# Altium project 28Pins_Project_v1I2.PrjPcb (part 2 of 3)
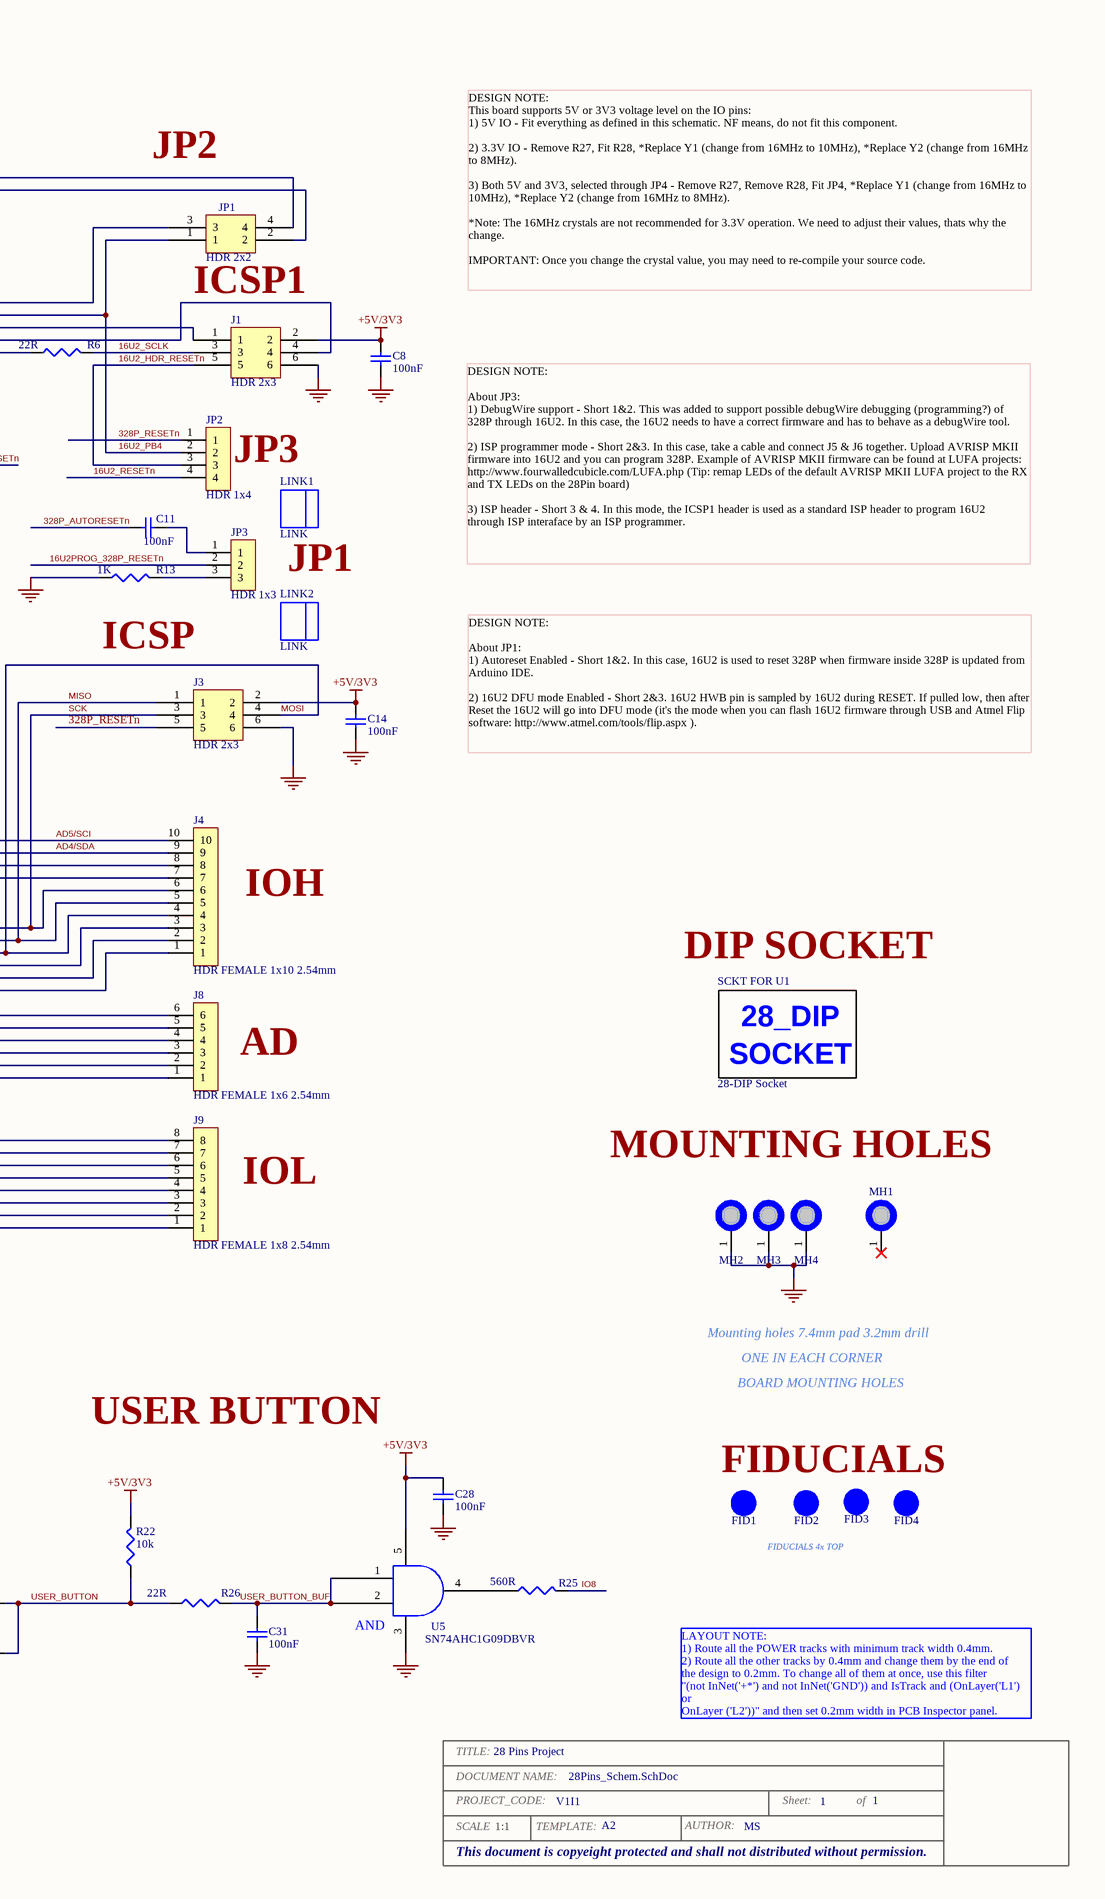
[diagram p2: 28Pins_Schem.SchDoc, right]

## Sheet 28Pins_Schem.SchDoc: 28 Pins Project (continued)
### Library data of the parts
28_Pins_Project = TitleBlock: Standard Title Block
C1 C12 C13 C15 C19 C21 C22 = C2012X5R1C106M125AC: CERAMIC CAPACITOR, 10UF, 16V, X5R, 20%, 0805, FULL REEL; Product Range:C Series; Capacitance:10 F; Capacitance Tolerance: 20%; Dielectric Characteristic:X5R; Voltage Rating:16V; Ceramic Capacitor Case:0805 [2012 Metric]; MSL:- ;RoHS Compliant: Yes; Manufacturer: TDK; Supplier 1: Farnell; Manufacturer Part Number: C2012X5R1C106M125AC; RoHS: Yes; Category: Ceramic Capacitors; Pricing 1: 5=0.27200, 50=0.09480, 250=0.08030, 500=0.07090, 1000=0.06220, 2000=0.04880, 10000=0.04830, 20000=0.04180 (GBP); Mount: Surface Mount; Case/Package: 0805; Number of Pins: 2; Case Code (Metric): 2012; Case Code (Imperial): 0805; Dielectric Material: Ceramic; Weight: 0.000194oz; Min Operating Temperature: -55°C; Max Operating Temperature: 85°C; Capacitance: 10uF; Tolerance: 20%; Voltage Rating: 16V; Packaging: Tape and Reel; Voltage Rating (DC): 16V; Dielectric: X5R; Termination: SMD/SMT; Package Quantity: 1; Resistor Type: Ceramic; Series: C; Length: 0.079inch; Width: 0.049inch; Height: 1.25mm; Depth: 1.25mm; Thickness: 0.057inch; RoHS Compliant: Yes; REACH SVHC: No SVHC; Lead Free: Lead Free; ComponentLink1URL: https://datasheet.ciiva.com/6289/tdkmlcccaprange-6289238.pdf?src-supplier=Digi-Key; ComponentLink1Description: https://datasheet.ciiva.com/6289/tdkmlcccaprange-6289238.pdf?src-supplier=Digi-Key; ComponentLink2URL: https://datasheet.ciiva.com/22725/1913358-22725558.pdf?src-supplier=Element14; ComponentLink2Description: https://datasheet.ciiva.com/22725/1913358-22725558.pdf?src-supplier=Element14; ComponentLink3URL: https://datasheet.ciiva.com/6252/tdkmlcccaprange-6252105.pdf?src-supplier=Digi-Key; ComponentLink3Description: https://datasheet.ciiva.com/6252/tdkmlcccaprange-6252105.pdf?src-supplier=Digi-Key; ComponentLink4URL: https://datasheet.ciiva.com/6252/tdkmlcccaprange-6252108.pdf?src-supplier=Digi-Key; ComponentLink4Description: https://datasheet.ciiva.com/6252/tdkmlcccaprange-6252108.pdf?src-supplier=Digi-Key; ComponentLink5URL: https://datasheet.ciiva.com/23803/1796654-23803022.pdf?src-supplier=Newark; ComponentLink5Description: https://datasheet.ciiva.com/23803/1796654-23803022.pdf?src-supplier=Newark; Supplier Part Number 1: 2525134
C2-C4 C8 C11 C14 C16-C18 C20 C23 C24 C27-C33 = C2012X7R1H104K085AA: C Series 0805 0.1 uF 50 V ±10 % Tolerance X7R SMT Multilayer Ceramic Capacitor; Manufacturer: TDK; Tolerance: 10%; Voltage Rating: 50V; Supplier 1: Newark; Manufacturer Part Number: C2012X7R1H104K085AA; RoHS: Yes; Category: Ceramic Capacitors; Stock 1: 16000; Pricing 1: 1=0.02600, 4000=0.02500, 8000=0.02400 (USD); Mount: Surface Mount; Case/Package: 0805; Number of Pins: 2; Case Code (Metric): 2012; Case Code (Imperial): 0805; Weight: 0.000194oz; Dielectric Material: Ceramic; Min Operating Temperature: -55°C; Max Operating Temperature: 125°C; Capacitance: 100nF; Dielectric: X7R; Packaging: Tape and Reel; Voltage Rating (DC): 50V; Termination: SMD/SMT; Construction: Flat; Package Quantity: 1; Resistor Type: Ceramic; Voltage: 50V; Series: C; Length: 2mm; Width: 0.049inch; Height: 0.85mm; Depth: 1.25mm; Thickness: 0.037inch; Radiation Hardening: No; RoHS Compliant: Yes; REACH SVHC: No SVHC; Lead Free: Lead Free; ComponentLink1URL: https://datasheet.ciiva.com/11788/0900766b80c1bb00-11788128.pdf?src-supplier=RSComponents; ComponentLink1Description: https://datasheet.ciiva.com/11788/0900766b80c1bb00-11788128.pdf?src-supplier=RSComponents; ComponentLink2URL: https://datasheet.ciiva.com/6250/tdkmlcccaprange-6250821.pdf?src-supplier=Digi-Key; ComponentLink2Description: https://datasheet.ciiva.com/6250/tdkmlcccaprange-6250821.pdf?src-supplier=Digi-Key; ComponentLink3URL: https://datasheet.ciiva.com/24191/e412-c-24191447.pdf?src-supplier=Future+Electronics; ComponentLink3Description: https://datasheet.ciiva.com/24191/e412-c-24191447.pdf?src-supplier=Future+Electronics; ComponentLink4URL: https://datasheet.ciiva.com/6250/tdkmlcccaprange-6250824.pdf?src-supplier=Digi-Key; ComponentLink4Description: https://datasheet.ciiva.com/6250/tdkmlcccaprange-6250824.pdf?src-supplier=Digi-Key; ComponentLink5URL: https://datasheet.ciiva.com/23803/1796654-23803035.pdf?src-supplier=Newark; ComponentLink5Description: https://datasheet.ciiva.com/23803/1796654-23803035.pdf?src-supplier=Newark; ComponentLink6URL: https://datasheet.ciiva.com/28602/1571323-28602204.pdf?src-supplier=Element14; ComponentLink6Description: https://datasheet.ciiva.com/28602/1571323-28602204.pdf?src-supplier=Element14; Supplier Part Number 1: 87R4037
C5 C6 = EEE-1AA101WR: SMD Aluminum Electrolytic Capacitor 100uF ±20% 10V 1000hrs@85°C AEC_D5.0x5.4mm_SM; Manufacturer: Panasonic; Ripple Current: 50mA; Life (Hours): 1000Hour; Supplier 1: RSComponents; Manufacturer Part Number: EEE-1AA101WR; RoHS: Yes; Category: Aluminum Electrolytic Capacitors; Stock 1: 1; Pricing 1: 1000=0.07800, 3000=0.07400 (USD); Mount: Surface Mount,PCB; Case/Package: Radial; Contact Plating: Tin; Min Operating Temperature: -40°C; Max Operating Temperature: 85°C; Capacitance: 100uF; Tolerance: 20%; Voltage Rating: 10V; Packaging: Tape and Reel; Package Quantity: 1; Voltage Rating (DC): 10V; Termination: SMD/SMT; Ripple Current (AC): 50mA; Series: S; Construction: Cylindrical; Diameter: 5mm; Length: 5.5mm; Height: 5.4mm; Height - Seated (Max): 0.213inch; Radiation Hardening: No; Lead Free: Lead Free; RoHS Compliant: Yes; REACH SVHC: Unknown; ComponentLink1URL: https://datasheet.ciiva.com/26945/getdatasheetpartid-169213-26945071.pdf?src-supplier=Verical; ComponentLink1Description: https://datasheet.ciiva.com/26945/getdatasheetpartid-169213-26945071.pdf?src-supplier=Verical; ComponentLink2URL: https://datasheet.ciiva.com/24027/aba0000ce2-40801-24027541.pdf?src-supplier=Mouser; ComponentLink2Description: https://datasheet.ciiva.com/24027/aba0000ce2-40801-24027541.pdf?src-supplier=Mouser; ComponentLink3URL: https://datasheet.ciiva.com/14598/70255710-14598233.pdf?src-supplier=Allied+Electronics; ComponentLink3Description: https://datasheet.ciiva.com/14598/70255710-14598233.pdf?src-supplier=Allied+Electronics; ComponentLink4URL: https://datasheet.ciiva.com/14605/70255710-14605689.pdf?src-supplier=Allied+Electronics; ComponentLink4Description: https://datasheet.ciiva.com/14605/70255710-14605689.pdf?src-supplier=Allied+Electronics; ComponentLink5URL: https://datasheet.ciiva.com/11673/aba0000ce2-11673882.pdf?src-supplier=Avnet; ComponentLink5Description: https://datasheet.ciiva.com/11673/aba0000ce2-11673882.pdf?src-supplier=Avnet; ComponentLink6URL: https://datasheet.ciiva.com/16427/aba0000ce2-16427544.pdf?src-supplier=Future+Electronics; ComponentLink6Description: https://datasheet.ciiva.com/16427/aba0000ce2-16427544.pdf?src-supplier=Future+Electronics; ComponentLink7URL: https://datasheet.ciiva.com/2983/aba0000ce2-2983906.pdf?src-supplier=Avnet; ComponentLink7Description: https://datasheet.ciiva.com/2983/aba0000ce2-2983906.pdf?src-supplier=Avnet; ComponentLink8URL: https://datasheet.ciiva.com/30075/11aba0000ce2-30075303.pdf?src-supplier=Onlinecomponents.com; ComponentLink8Description: https://datasheet.ciiva.com/30075/11aba0000ce2-30075303.pdf?src-supplier=Onlinecomponents.com; Supplier Part Number 1: 1763738
C7 = C2012X5R1E105K125AA: TDK - C2012X5R1E105K125AA - SMD Multilayer Ceramic Capacitor, 1 µF, 25 V, 0805 [2012 Metric], ± 10%, X5R, C Series; Supplier 1: Newark; Manufacturer: TDK; Manufacturer Part Number: C2012X5R1E105K125AA; RoHS: Yes; Category: Ceramic Capacitors; Stock 1: 4000; Pricing 1: 1=0.06600, 2000=0.06400, 4000=0.06000 (USD); Mount: Surface Mount; Case/Package: 0805; Number of Pins: 2; Case Code (Metric): 2012; Case Code (Imperial): 0805; Dielectric Material: Ceramic; Weight: 0.000194oz; Min Operating Temperature: -55°C; Max Operating Temperature: 85°C; Tolerance: 10%; Capacitance: 1uF; Voltage Rating: 25V; Packaging: Tape and Reel; Voltage Rating (DC): 25V; Dielectric: X5R; Termination: SMD/SMT; Construction: Flat; Package Quantity: 2000; Resistor Type: Ceramic; Voltage: 25V; Series: C; Length: 2mm; Width: 0.049inch; Height: 1.25mm; Depth: 1.25mm; Thickness: 0.057inch; Radiation Hardening: No; Lead Free: Lead Free; RoHS Compliant: Yes; REACH SVHC: No SVHC; ComponentLink1URL: https://datasheet.ciiva.com/11787/0900766b80c1bb00-11787608.pdf?src-supplier=RSComponents; ComponentLink1Description: https://datasheet.ciiva.com/11787/0900766b80c1bb00-11787608.pdf?src-supplier=RSComponents; ComponentLink2URL: https://datasheet.ciiva.com/16449/e412-c-16449595.pdf?src-supplier=Future+Electronics; ComponentLink2Description: https://datasheet.ciiva.com/16449/e412-c-16449595.pdf?src-supplier=Future+Electronics; ComponentLink3URL: https://datasheet.ciiva.com/28602/1744655-28602171.pdf?src-supplier=Element14; ComponentLink3Description: https://datasheet.ciiva.com/28602/1744655-28602171.pdf?src-supplier=Element14; ComponentLink4URL: https://datasheet.ciiva.com/15192/getdatasheetpartid-726707-15192140.pdf?src-supplier=Verical; ComponentLink4Description: https://datasheet.ciiva.com/15192/getdatasheetpartid-726707-15192140.pdf?src-supplier=Verical; Supplier Part Number 1: 87R3963
C9 C10 C25 C26 = C0805C180J5GACTU: Cap Ceramic 18pF 50V C0G 5% SMD 0805 125C Paper T/R; Manufacturer: KEMET; Temperature Coefficient: 30ppm/°C; Dissipation Factor: 0.1%; Supplier 1: RSComponents; Manufacturer Part Number: C0805C180J5GACTU; RoHS: Yes; Category: Ceramic Capacitors; Stock 1: 6900; Pricing 1: 10=0.05100, 100=0.03800, 500=0.02500, 1000=0.02400 (USD); Mount: Surface Mount,PCB; Case/Package: 0805; Number of Pins: 2; Dielectric Material: Ceramic; Contact Plating: Tin,Matte; Contact Material: Tin; Case Code (Imperial): 0805; Case Code (Metric): 2012; Min Operating Temperature: -55°C; Max Operating Temperature: 125°C; Tolerance: 5%; Capacitance: 18pF; Packaging: Tape and Reel; Dielectric: C0G; Voltage: 50V; Termination: SMD/SMT; Voltage Rating (DC): 50V; Package Quantity: 1; Voltage Rating: 50V; Series: C; Construction: Flat; Length: 2mm; Width: 1.2mm; Height: 0.78mm; Depth: 1.25mm; Lead Pitch: 0.75mm; Thickness: 0.035inch; Radiation Hardening: No; Lead Free: Lead Free; REACH SVHC: No SVHC; RoHS Compliant: Yes; ComponentLink1URL: https://datasheet.ciiva.com/22746/1769375-22746770.pdf?src-supplier=Element14; ComponentLink1Description: https://datasheet.ciiva.com/22746/1769375-22746770.pdf?src-supplier=Element14; ComponentLink2URL: https://datasheet.ciiva.com/26923/getdatasheetpartid-759702-26923980.pdf?src-supplier=Verical; ComponentLink2Description: https://datasheet.ciiva.com/26923/getdatasheetpartid-759702-26923980.pdf?src-supplier=Verical; ComponentLink3URL: https://datasheet.ciiva.com/26847/getdatasheetpartid-385668-26847862.pdf?src-supplier=Verical; ComponentLink3Description: https://datasheet.ciiva.com/26847/getdatasheetpartid-385668-26847862.pdf?src-supplier=Verical; Supplier Part Number 1: 6480935
D1 D2 = LOL29K-H2K1-24-Z: Smartled Orange Lc; Manufacturer: Osram Opto; Lens Color: White; Forward Current: 20mA; Forward Voltage: 2.2V; Luminous Intensity: 9mcd; Viewing Angle: 160°; Lens Style: Flat,Diffused,Colorless,Rectangular; Test Current: 2mA; Dominant Wavelength: 606nm; Luminous Flux: 0.025lm; Number of LEDs: 1; Lens Transparency: Diffused; Reverse Voltage: 12V; Lens Size: 0.8mm; Supplier 1: Newark; Manufacturer Part Number: LOL29K-H2K1-24-Z; RoHS: Yes; Category: Uncategorized; Mount: Surface Mount; Case/Package: 0603; Number of Pins: 2; Color: Orange; Case Code (Metric): 1608; Case Code (Imperial): 0603; Min Operating Temperature: -40°C; Max Operating Temperature: 100°C; Illumination Color: Orange; Packaging: Tape and Reel; Package Quantity: 5000; Number of Elements: 1; Series: SmartLED; Length: 1.3mm; Width: 0.8mm; Height: 0.65mm; Depth: 0.8mm; Radiation Hardening: No; RoHS Compliant: Yes; ComponentLink1URL: https://datasheet.ciiva.com/2112/00077105-0-2112905.pdf?src-supplier=Digi-Key; ComponentLink1Description: https://datasheet.ciiva.com/2112/00077105-0-2112905.pdf?src-supplier=Digi-Key; ComponentLink2URL: https://datasheet.ciiva.com/2112/00077105-0-2112904.pdf?src-supplier=Digi-Key; ComponentLink2Description: https://datasheet.ciiva.com/2112/00077105-0-2112904.pdf?src-supplier=Digi-Key; ComponentLink3URL: https://datasheet.ciiva.com/2112/00077105-0-2112906.pdf?src-supplier=Digi-Key; ComponentLink3Description: https://datasheet.ciiva.com/2112/00077105-0-2112906.pdf?src-supplier=Digi-Key; ComponentLink4URL: https://datasheet.ciiva.com/15198/getdatasheetpartid-693885-15198412.pdf?src-supplier=Verical; ComponentLink4Description: https://datasheet.ciiva.com/15198/getdatasheetpartid-693885-15198412.pdf?src-supplier=Verical; Supplier Part Number 1: 32AC1122
D3 D4 = LGL29K-G2J1-24-Z: LED Single Chip Green 570nm 20mA 2-Pin 0603 T/R; Manufacturer: Osram Opto; Lens Color: White; Forward Voltage: 2.2V; Luminous Intensity: 5.6mcd; Viewing Angle: 160°; Lens Style: Flat,Diffused,Colorless,Rectangular; Test Current: 2mA; Luminous Flux: 0.012lm; Number of LEDs: 1; Lens Transparency: Diffused; Reverse Voltage: 12V; Lens Size: 0.8mm; Supplier 1: Newark; Manufacturer Part Number: LGL29K-G2J1-24-Z; RoHS: Yes; Category: LEDs; Mount: Surface Mount; Case/Package: 0603; Number of Pins: 2; Color: Green; Case Code (Metric): 1608; Case Code (Imperial): 0603; Min Operating Temperature: -40°C; Max Operating Temperature: 100°C; Illumination Color: Green; Forward Current: 20mA; Packaging: Tape and Reel; Package Quantity: 5000; Dominant Wavelength: 570nm; Number of Elements: 1; Series: SmartLED; Length: 1.3mm; Width: 0.8mm; Height: 0.65mm; Depth: 0.8mm; Radiation Hardening: No; RoHS Compliant: Yes; ComponentLink1URL: https://datasheet.ciiva.com/4689/g-l29k-39844-4689584.pdf?src-supplier=Mouser; ComponentLink1Description: https://datasheet.ciiva.com/4689/g-l29k-39844-4689584.pdf?src-supplier=Mouser; ComponentLink2URL: https://datasheet.ciiva.com/15198/getdatasheetpartid-571127-15198411.pdf?src-supplier=Verical; ComponentLink2Description: https://datasheet.ciiva.com/15198/getdatasheetpartid-571127-15198411.pdf?src-supplier=Verical; ComponentLink3URL: https://datasheet.ciiva.com/2112/00077107-0-2112887.pdf?src-supplier=Digi-Key; ComponentLink3Description: https://datasheet.ciiva.com/2112/00077107-0-2112887.pdf?src-supplier=Digi-Key; ComponentLink4URL: https://datasheet.ciiva.com/2112/00077107-0-2112886.pdf?src-supplier=Digi-Key; ComponentLink4Description: https://datasheet.ciiva.com/2112/00077107-0-2112886.pdf?src-supplier=Digi-Key; ComponentLink5URL: https://datasheet.ciiva.com/2112/00077107-0-2112888.pdf?src-supplier=Digi-Key; ComponentLink5Description: https://datasheet.ciiva.com/2112/00077107-0-2112888.pdf?src-supplier=Digi-Key; Supplier Part Number 1: 35AH2059
D5 D6 = BAT54HT1G: VR=30V IF=200mA 10pF P=200mW; Manufacturer: ON Semiconductor / Fairchild; Forward Voltage: 800mV; Forward Current: 200mA; Recovery Time: 5ns; Max Repetitive Reverse Voltage (Vrrm): 30V; Peak Non-Repetitive Surge Current: 600mA; Element Configuration: Single; Max Reverse Current: 2uA; Power Dissipation: 200mW; Polarity: Standard; Supplier 1: Digi-Key; Manufacturer Part Number: BAT54HT1G; RoHS: Yes; Category: Schottky Diodes; Stock 1: 26140; Pricing 1: 3000=0.04267, 6000=0.03710, 15000=0.03153, 30000=0.03063 (USD); Mount: Surface Mount; Number of Pins: 2; Contact Plating: Tin,Matte; Min Operating Temperature: -55°C; Max Operating Temperature: 150°C; Packaging: Tape and Reel; Package Quantity: 3000; Average Rectified Current: 200mA; Reverse Recovery Time: 5ns; Max Forward Surge Current (Ifsm): 600mA; Max Reverse Voltage (DC): 30V; Max Surge Current: 600mA; Voltage Rating (DC): 30V; Current Rating: 200mA; Capacitance: 10pF; Output Current: 200mA; Reverse Voltage: 30V; Max Reverse Leakage Current: 2uA; Length: 1.8mm; Width: 1.35mm; Height: 1mm; Radiation Hardening: No; Lead Free: Lead Free; RoHS Compliant: Yes; REACH SVHC: No SVHC; ComponentLink1URL: https://datasheet.ciiva.com/4714/bat54ht1-d-72881-4714706.pdf?src-supplier=Mouser; ComponentLink1Description: https://datasheet.ciiva.com/4714/bat54ht1-d-72881-4714706.pdf?src-supplier=Mouser; ComponentLink2URL: https://datasheet.ciiva.com/4452/bat54ht1g-104602-4452889.pdf?src-supplier=Mouser; ComponentLink2Description: https://datasheet.ciiva.com/4452/bat54ht1g-104602-4452889.pdf?src-supplier=Mouser; ComponentLink3URL: https://datasheet.ciiva.com/30479/0900766b811a63a9-30479442.pdf?src-supplier=RSComponents; ComponentLink3Description: https://datasheet.ciiva.com/30479/0900766b811a63a9-30479442.pdf?src-supplier=RSComponents; ComponentLink4URL: https://datasheet.ciiva.com/34301/806549-34301562.pdf?src-supplier=Jameco; ComponentLink4Description: https://datasheet.ciiva.com/34301/806549-34301562.pdf?src-supplier=Jameco; ComponentLink5URL: https://datasheet.ciiva.com/1240/1747983-1240762.pdf?src-supplier=Newark; ComponentLink5Description: https://datasheet.ciiva.com/1240/1747983-1240762.pdf?src-supplier=Newark; ComponentLink6URL: https://datasheet.ciiva.com/915/bat54ht1-d-915445.pdf?src-supplier=Digi-Key; ComponentLink6Description: https://datasheet.ciiva.com/915/bat54ht1-d-915445.pdf?src-supplier=Digi-Key; ComponentLink7URL: https://datasheet.ciiva.com/915/bat54ht1-d-915444.pdf?src-supplier=Digi-Key; ComponentLink7Description: https://datasheet.ciiva.com/915/bat54ht1-d-915444.pdf?src-supplier=Digi-Key; ComponentLink8URL: https://datasheet.ciiva.com/910/bat54ht1g-910499.pdf?src-supplier=Digi-Key; ComponentLink8Description: https://datasheet.ciiva.com/910/bat54ht1g-910499.pdf?src-supplier=Digi-Key; ComponentLink9URL: https://datasheet.ciiva.com/910/bat54ht1g-910498.pdf?src-supplier=Digi-Key; ComponentLink9Description: https://datasheet.ciiva.com/910/bat54ht1g-910498.pdf?src-supplier=Digi-Key; ComponentLink10URL: https://datasheet.ciiva.com/8294/bat54ht1-d-8294645.pdf?src-supplier=Avnet; ComponentLink10Description: https://datasheet.ciiva.com/8294/bat54ht1-d-8294645.pdf?src-supplier=Avnet; ComponentLink11URL: https://datasheet.ciiva.com/910/bat54ht1g-910497.pdf?src-supplier=Digi-Key; ComponentLink11Description: https://datasheet.ciiva.com/910/bat54ht1g-910497.pdf?src-supplier=Digi-Key; ComponentLink12URL: https://datasheet.ciiva.com/8303/bat54ht1g-8303645.pdf?src-supplier=Avnet; ComponentLink12Description: https://datasheet.ciiva.com/8303/bat54ht1g-8303645.pdf?src-supplier=Avnet; ComponentLink13URL: https://datasheet.ciiva.com/915/bat54ht1-d-915443.pdf?src-supplier=Digi-Key; ComponentLink13Description: https://datasheet.ciiva.com/915/bat54ht1-d-915443.pdf?src-supplier=Digi-Key; ComponentLink14URL: https://datasheet.ciiva.com/46429/1727620-46429206.pdf?src-supplier=Element14; ComponentLink14Description: https://datasheet.ciiva.com/46429/1727620-46429206.pdf?src-supplier=Element14; ComponentLink15URL: https://datasheet.ciiva.com/1180/bat54ht1-d-1180252.pdf?src-supplier=Element14; ComponentLink15Description: https://datasheet.ciiva.com/1180/bat54ht1-d-1180252.pdf?src-supplier=Element14; ComponentLink16URL: https://datasheet.ciiva.com/1180/bat54ht1-d-1180251.pdf?src-supplier=Element14; ComponentLink16Description: https://datasheet.ciiva.com/1180/bat54ht1-d-1180251.pdf?src-supplier=Element14; ComponentLink17URL: https://datasheet.ciiva.com/17020/bat54ht1g-17020445.pdf?src-supplier=Future+Electronics; ComponentLink17Description: https://datasheet.ciiva.com/17020/bat54ht1g-17020445.pdf?src-supplier=Future+Electronics; ComponentLink18URL: https://datasheet.ciiva.com/48686/001262925-da-01-en-diode-schottky-30v-bat54ht1g-sod-323-fsc-48686266.pdf?src-supplier=Conrad; ComponentLink18Description: https://datasheet.ciiva.com/48686/001262925-da-01-en-diode-schottky-30v-bat54ht1g-sod-323-fsc-48686266.pdf?src-supplier=Conrad; Supplier Part Number 1: BAT54HT1GOSTR-ND
FB1-FB3 = MPZ2012S601AT000: 0805 600Ω ±25% DCR=0.1Ω 2A; Manufacturer: TDK; Impedance: 600R; DC Resistance (DCR): 100mR; Supplier 1: Digi-Key; Manufacturer Part Number: MPZ2012S601AT000; RoHS: Yes; Category: Ferrite Beads and Chips; Pricing 1: 1=0.12000, 10=0.10100, 25=0.09040, 50=0.06640, 100=0.05740, 250=0.04528, 500=0.03824, 1000=0.03221 (USD); Mount: Surface Mount; Case/Package: 0805; Case Code (Metric): 2012; Case Code (Imperial): 0805; Packaging: Tape and Reel; Package Quantity: 1; Current Rating: 2A; Max DC Current: 2A; Series: MPZ; Length: 0.079inch; Width: 0.049inch; Height: 0.041inch; REACH SVHC: No SVHC; Lead Free: Lead Free; RoHS Compliant: Yes; ComponentLink1URL: https://datasheet.ciiva.com/46634/beads-commercial-power-mpz-en-46634335.pdf?src-supplier=Digi-Key; ComponentLink1Description: https://datasheet.ciiva.com/46634/beads-commercial-power-mpz-en-46634335.pdf?src-supplier=Digi-Key; ComponentLink2URL: https://datasheet.ciiva.com/46634/beads-commercial-power-mpz-en-46634377.pdf?src-supplier=Digi-Key; ComponentLink2Description: https://datasheet.ciiva.com/46634/beads-commercial-power-mpz-en-46634377.pdf?src-supplier=Digi-Key; ComponentLink3URL: https://datasheet.ciiva.com/46634/beads-commercial-power-mpz-en-46634606.pdf?src-supplier=Digi-Key; ComponentLink3Description: https://datasheet.ciiva.com/46634/beads-commercial-power-mpz-en-46634606.pdf?src-supplier=Digi-Key; Supplier Part Number 1: 445-2206-6-ND
FID1-FID4 = FID_1MMC: Fiducials 40mm Diameter, 120mm Mask
J1 J3 = 67997-106HLF: Conn Unshrouded Header HDR 6 POS 2.54mm Solder ST Top Entry Thru-Hole BergStik® Bulk; Manufacturer: Amphenol ICC / FCI; Supplier 1: Avnet; Manufacturer Part Number: 67997-106HLF; RoHS: No; Category: Headers and Wire Housings; Stock 1: 9; Pricing 1: 1=1.53000 (USD); ComponentLink1URL: http://components.arrow.com/part/dataview/0323_00898189?src-supplier=Arrow+Europe; ComponentLink1Description: http://components.arrow.com/part/dataview/0323_00898189?src-supplier=Arrow+Europe; ComponentLink2URL: http://uk.rs-online.com/webdocs/1450/0900766b81450b8b.pdf?src-supplier=RSComponents; ComponentLink2Description: http://uk.rs-online.com/webdocs/1450/0900766b81450b8b.pdf?src-supplier=RSComponents; ComponentLink3URL: http://www.farnell.com/datasheets/1876884.pdf?src-supplier=Newark; ComponentLink3Description: http://www.farnell.com/datasheets/1876884.pdf?src-supplier=Newark; ComponentLink4URL: http://www.farnell.com/datasheets/1876884.pdf?src-supplier=Farnell; ComponentLink4Description: http://www.farnell.com/datasheets/1876884.pdf?src-supplier=Farnell; ComponentLink5URL: https://cdn.amphenol-icc.com/media/wysiwyg/files/drawing/67996.pdf?src-supplier=Digi-Key; ComponentLink5Description: https://cdn.amphenol-icc.com/media/wysiwyg/files/drawing/67996.pdf?src-supplier=Digi-Key; ComponentLink6URL: https://cdn.amphenol-icc.com/media/wysiwyg/files/drawing/67996.pdf?src-supplier=Mouser; ComponentLink6Description: https://cdn.amphenol-icc.com/media/wysiwyg/files/drawing/67996.pdf?src-supplier=Mouser; ComponentLink7URL: https://cdn.amphenol-icc.com/media/wysiwyg/files/drawing/67996.pdf?src-supplier=Avnet; ComponentLink7Description: https://cdn.amphenol-icc.com/media/wysiwyg/files/drawing/67996.pdf?src-supplier=Avnet; ComponentLink8URL: http://components.arrow.com/part/dataview/41913658S7633350N8314?src-supplier=Arrow+Electronics; ComponentLink8Description: http://components.arrow.com/part/dataview/41913658S7633350N8314?src-supplier=Arrow+Electronics; ComponentLink9URL: https://cdn.amphenol-icc.com/media/wysiwyg/files/drawing/67996.pdf?src-supplier=Onlinecomponents.com; ComponentLink9Description: https://cdn.amphenol-icc.com/media/wysiwyg/files/drawing/67996.pdf?src-supplier=Onlinecomponents.com; ComponentLink10URL: https://cdn.amphenol-icc.com/media/wysiwyg/files/drawing/67996.pdf?src-supplier=Avnet+Europe; ComponentLink10Description: https://cdn.amphenol-icc.com/media/wysiwyg/files/drawing/67996.pdf?src-supplier=Avnet+Europe; ComponentLink11URL: https://cdn.amphenol-icc.com/media/wysiwyg/files/drawing/67996.pdf?src-supplier=Avnet+Asia; ComponentLink11Description: https://cdn.amphenol-icc.com/media/wysiwyg/files/drawing/67996.pdf?src-supplier=Avnet+Asia; ComponentLink12URL: https://cdn.amphenol-icc.com/media/wysiwyg/files/drawing/67996.pdf?src-supplier=Allied+Electronics; ComponentLink12Description: https://cdn.amphenol-icc.com/media/wysiwyg/files/drawing/67996.pdf?src-supplier=Allied+Electronics; ComponentLink13URL: https://cdn.amphenol-icc.com/media/wysiwyg/files/drawing/67996.pdf?src-supplier=TTI; ComponentLink13Description: https://cdn.amphenol-icc.com/media/wysiwyg/files/drawing/67996.pdf?src-supplier=TTI; ComponentLink14URL: https://cdn.amphenol-icc.com/media/wysiwyg/files/drawing/67996.pdf?src-supplier=Heilind+Electronics; ComponentLink14Description: https://cdn.amphenol-icc.com/media/wysiwyg/files/drawing/67996.pdf?src-supplier=Heilind+Electronics; Supplier Part Number 1: 06M1758
J2 = 10118193-0001LF: FCI Right Angle Surface Mount Mount Female USB Connector; 100 V ac; 1.8A; Manufacturer: Amphenol ICC / FCI; Supplier 1: RSComponents; Manufacturer Part Number: 10118193-0001LF; RoHS: No; Category: USB Connectors; Stock 1: 3200; Pricing 1: 100=0.34000, 500=0.29900, 1000=0.25600, 2500=0.23900, 5000=0.22100 (USD); ComponentLink1URL: http://components.arrow.com/part/dataview/0323_04107372?src-supplier=Arrow+Europe; ComponentLink1Description: http://components.arrow.com/part/dataview/0323_04107372?src-supplier=Arrow+Europe; ComponentLink2URL: http://uk.rs-online.com/webdocs/1450/0900766b814507f1.pdf?src-supplier=RSComponents; ComponentLink2Description: http://uk.rs-online.com/webdocs/1450/0900766b814507f1.pdf?src-supplier=RSComponents; ComponentLink3URL: https://cdn.amphenol-icc.com/media/wysiwyg/files/documentation/datasheet/inputoutput/io_usb_micro.pdf?src-supplier=Avnet; ComponentLink3Description: https://cdn.amphenol-icc.com/media/wysiwyg/files/documentation/datasheet/inputoutput/io_usb_micro.pdf?src-supplier=Avnet; ComponentLink4URL: https://cdn.amphenol-icc.com/media/wysiwyg/files/documentation/datasheet/inputoutput/io_usb_micro.pdf?src-supplier=Arrow+Electronics; ComponentLink4Description: https://cdn.amphenol-icc.com/media/wysiwyg/files/documentation/datasheet/inputoutput/io_usb_micro.pdf?src-supplier=Arrow+Electronics; ComponentLink5URL: https://cdn.amphenol-icc.com/media/wysiwyg/files/documentation/datasheet/inputoutput/io_usb_micro.pdf?src-supplier=Onlinecomponents.com; ComponentLink5Description: https://cdn.amphenol-icc.com/media/wysiwyg/files/documentation/datasheet/inputoutput/io_usb_micro.pdf?src-supplier=Onlinecomponents.com; ComponentLink6URL: https://cdn.amphenol-icc.com/media/wysiwyg/files/documentation/datasheet/inputoutput/io_usb_micro.pdf?src-supplier=Verical; ComponentLink6Description: https://cdn.amphenol-icc.com/media/wysiwyg/files/documentation/datasheet/inputoutput/io_usb_micro.pdf?src-supplier=Verical; ComponentLink7URL: http://www.amphenol-icc.com/media/wysiwyg/files/drawing/10118193.pdf?src-supplier=Digi-Key; ComponentLink7Description: http://www.amphenol-icc.com/media/wysiwyg/files/drawing/10118193.pdf?src-supplier=Digi-Key; ComponentLink8URL: https://cdn.amphenol-icc.com/media/wysiwyg/files/documentation/datasheet/inputoutput/io_usb_micro.pdf?src-supplier=Digi-Key; ComponentLink8Description: https://cdn.amphenol-icc.com/media/wysiwyg/files/documentation/datasheet/inputoutput/io_usb_micro.pdf?src-supplier=Digi-Key; ComponentLink9URL: https://cdn.amphenol-icc.com/media/wysiwyg/files/documentation/datasheet/inputoutput/io_usb_micro.pdf?src-supplier=Mouser; ComponentLink9Description: https://cdn.amphenol-icc.com/media/wysiwyg/files/documentation/datasheet/inputoutput/io_usb_micro.pdf?src-supplier=Mouser; ComponentLink10URL: https://cdn.amphenol-icc.com/media/wysiwyg/files/documentation/datasheet/inputoutput/io_usb_micro.pdf?src-supplier=Allied+Electronics; ComponentLink10Description: https://cdn.amphenol-icc.com/media/wysiwyg/files/documentation/datasheet/inputoutput/io_usb_micro.pdf?src-supplier=Allied+Electronics; ComponentLink11URL: https://cdn.amphenol-icc.com/media/wysiwyg/files/documentation/datasheet/inputoutput/io_usb_micro.pdf?src-supplier=RSComponents; ComponentLink11Description: https://cdn.amphenol-icc.com/media/wysiwyg/files/documentation/datasheet/inputoutput/io_usb_micro.pdf?src-supplier=RSComponents; ComponentLink12URL: https://cdn.amphenol-icc.com/media/wysiwyg/files/documentation/datasheet/inputoutput/io_usb_micro.pdf?src-supplier=TTI; ComponentLink12Description: https://cdn.amphenol-icc.com/media/wysiwyg/files/documentation/datasheet/inputoutput/io_usb_micro.pdf?src-supplier=TTI; ComponentLink13URL: https://cdn.amphenol-icc.com/media/wysiwyg/files/documentation/datasheet/inputoutput/io_usb_micro.pdf?src-supplier=TME; ComponentLink13Description: https://cdn.amphenol-icc.com/media/wysiwyg/files/documentation/datasheet/inputoutput/io_usb_micro.pdf?src-supplier=TME; ComponentLink14URL: https://cdn.amphenol-icc.com/media/wysiwyg/files/documentation/datasheet/inputoutput/io_usb_micro.pdf?src-supplier=Heilind+Electronics; ComponentLink14Description: https://cdn.amphenol-icc.com/media/wysiwyg/files/documentation/datasheet/inputoutput/io_usb_micro.pdf?src-supplier=Heilind+Electronics; Supplier Part Number 1: 8632989
J4 = M20-7821046: 2.54mm (0.1") Pitch SIL Vertical PC Tail Socket Assembly, tin, 10 contacts; Manufacturer: Harwin; Number of Contacts: 10; Connector Type: Receptacle,Socket; Gender: Receptacle; Insulation Resistance: 1MR; Max Current Rating: 3A; Contact Resistance: 20mR; Mating Cycles: 50; Hole Diameter: 0.8mm; Supplier 1: RSComponents; Manufacturer Part Number: M20-7821046; RoHS: Yes; Category: Headers and Wire Housings; Stock 1: 540; Pricing 1: 5=1.51500, 100=1.15800, 375=1.04500, 1500=0.84700, 3000=0.76700 (USD); Mount: Through Hole; Case/Package: SIL; Housing Color: Black; Color: Black; Contact Plating: Tin; Contact Material: Bronze; Housing Material: Polyamide; Min Operating Temperature: -40°C; Max Operating Temperature: 105°C; Termination: Solder; Number of Rows: 1; Orientation: Straight; Number of Positions: 10; Packaging: Rail/Tube; Contact Gender: Female; Package Quantity: 23; Current Rating: 3A; Length: 25.8mm; Pitch: 2.54mm; Depth: 2.5mm; Lead Pitch: 2.54mm; Radiation Hardening: No; REACH SVHC: No SVHC; ComponentLink1URL: https://datasheet.ciiva.com/26899/getdatasheetpartid-559226-26899379.pdf?src-supplier=Verical; ComponentLink1Description: https://datasheet.ciiva.com/26899/getdatasheetpartid-559226-26899379.pdf?src-supplier=Verical; ComponentLink2URL: https://datasheet.ciiva.com/11753/0900766b80dc1d2b-11753869.pdf?src-supplier=RSComponents; ComponentLink2Description: https://datasheet.ciiva.com/11753/0900766b80dc1d2b-11753869.pdf?src-supplier=RSComponents; ComponentLink3URL: https://datasheet.ciiva.com/6785/m20-782-6785605.pdf?src-supplier=Digi-Key; ComponentLink3Description: https://datasheet.ciiva.com/6785/m20-782-6785605.pdf?src-supplier=Digi-Key; ComponentLink4URL: https://datasheet.ciiva.com/10151/m20-782-10151366.pdf?src-supplier=Avnet; ComponentLink4Description: https://datasheet.ciiva.com/10151/m20-782-10151366.pdf?src-supplier=Avnet; ComponentLink5URL: https://datasheet.ciiva.com/16732/m20-782-16732152.pdf?src-supplier=Avnet+Europe; ComponentLink5Description: https://datasheet.ciiva.com/16732/m20-782-16732152.pdf?src-supplier=Avnet+Europe; Supplier Part Number 1: 6816826
J5 J7 = PAD_WITH_HOLE_4MMx1.5MM: Pad with a hole 4mm x 1.5mm
J6 J9 = M20-7820842: 2.54mm (0.1") Pitch SIL Vertical PC Tail Socket Assembly, selective gold + tin, 8 contacts; Manufacturer: Harwin; Number of Contacts: 8; Max Current Rating: 3A; Contact Resistance: 20mR; Connector Type: Receptacle; Supplier 1: Newark; Manufacturer Part Number: M20-7820842; RoHS: Yes; Category: Headers and Wire Housings; Stock 1: 1771; Pricing 1: 1=1.30000, 100=1.03000, 250=0.93600, 500=0.85400, 1000=0.79500 (USD); Mount: Through Hole; Case/Package: SIL; Contact Plating: Tin,Gold; Color: Black; Contact Material: Bronze; Weight: 0.025397oz; Housing Color: Black; Housing Material: Polyamide; Min Operating Temperature: -40°C; Max Operating Temperature: 105°C; Number of Rows: 1; Termination: Solder; Contact Gender: Female; Package Quantity: 29; Packaging: Rail/Tube; Number of Positions: 8; Orientation: Straight; Gender: Female; Series: M20; Contact Type: Female Socket; Length: 20.72mm; Pitch: 2.54mm; Depth: 2.5mm; Radiation Hardening: No; RoHS Compliant: Yes; ComponentLink1URL: https://datasheet.ciiva.com/16732/m20-782-16732663.pdf?src-supplier=Avnet+Europe; ComponentLink1Description: https://datasheet.ciiva.com/16732/m20-782-16732663.pdf?src-supplier=Avnet+Europe; ComponentLink2URL: https://datasheet.ciiva.com/9480/m20-782-9480074.pdf?src-supplier=Avnet; ComponentLink2Description: https://datasheet.ciiva.com/9480/m20-782-9480074.pdf?src-supplier=Avnet; Supplier Part Number 1: 29AH6736
J8 = M20-7820646: 2.54mm (0.1") Pitch SIL Vertical PC Tail Socket Assembly, tin, 6 contacts; Manufacturer: Harwin; Number of Contacts: 6; Max Current Rating: 3A; Contact Resistance: 20mR; Connector Type: Receptacle; Supplier 1: RSComponents; Manufacturer Part Number: M20-7820646; RoHS: Yes; Category: Headers and Wire Housings; Stock 1: 900; Pricing 1: 36=0.99000, 180=0.92500, 360=0.82600, 720=0.74400 (USD); Mount: Through Hole; Case/Package: SIL; Color: Black; Contact Plating: Tin; Contact Material: Bronze; Housing Color: Black; Housing Material: Nylon; Min Operating Temperature: -40°C; Max Operating Temperature: 105°C; Number of Rows: 1; Termination: Solder; Packaging: Rail/Tube; Contact Gender: Female; Package Quantity: 38; Number of Positions: 6; Orientation: Straight; Gender: Female; Series: M20; Contact Type: Female Socket; Length: 15.64mm; Pitch: 2.54mm; Depth: 2.5mm; Radiation Hardening: No; RoHS Compliant: Yes; ComponentLink1URL: http://components.arrow.com/part/dataview/0323_00725884?src-supplier=Arrow+Europe; ComponentLink1Description: http://components.arrow.com/part/dataview/0323_00725884?src-supplier=Arrow+Europe; ComponentLink2URL: http://www.harwin.com/include/downloads/pdfs/2010PAGE120.PDF?src-supplier=Avnet; ComponentLink2Description: http://www.harwin.com/include/downloads/pdfs/2010PAGE120.PDF?src-supplier=Avnet; ComponentLink3URL: https://cdn.harwin.com/pdfs/M20-782.pdf?src-supplier=Digi-Key; ComponentLink3Description: https://cdn.harwin.com/pdfs/M20-782.pdf?src-supplier=Digi-Key; ComponentLink4URL: https://cdn.harwin.com/pdfs/Harwin_PC_Connectors_M20.pdf?src-supplier=Avnet+Europe; ComponentLink4Description: https://cdn.harwin.com/pdfs/Harwin_PC_Connectors_M20.pdf?src-supplier=Avnet+Europe; ComponentLink5URL: https://cdn.harwin.com/pdfs/Harwin_PC_Connectors_M20.pdf?src-supplier=RSComponents; ComponentLink5Description: https://cdn.harwin.com/pdfs/Harwin_PC_Connectors_M20.pdf?src-supplier=RSComponents; ComponentLink6URL: https://cdn.harwin.com/pdfs/Harwin_PC_Connectors_M20.pdf?src-supplier=Mouser; ComponentLink6Description: https://cdn.harwin.com/pdfs/Harwin_PC_Connectors_M20.pdf?src-supplier=Mouser; ComponentLink7URL: https://cdn.harwin.com/pdfs/Harwin_PC_Connectors_M20.pdf?src-supplier=TTI; ComponentLink7Description: https://cdn.harwin.com/pdfs/Harwin_PC_Connectors_M20.pdf?src-supplier=TTI; Supplier Part Number 1: 1613515
JP1 = 68602-204HLF: Conn Unshrouded Header HDR 4 POS 2.54mm Solder ST Top Entry Thru-Hole BergStik® Bulk; Manufacturer: Amphenol ICC / FCI; Supplier 1: Avnet; Manufacturer Part Number: 68602-204HLF; RoHS: No; Category: Connectors; Stock 1: 10; Pricing 1: 1=0.36700, 10=0.24900, 25=0.23400, 50=0.22000, 100=0.20500, 250=0.19300 (USD); ComponentLink1URL: https://cdn.amphenol-icc.com/media/wysiwyg/files/drawing/67996.pdf?src-supplier=Digi-Key; ComponentLink1Description: https://cdn.amphenol-icc.com/media/wysiwyg/files/drawing/67996.pdf?src-supplier=Digi-Key; ComponentLink2URL: https://cdn.amphenol-icc.com/media/wysiwyg/files/drawing/67996.pdf?src-supplier=Avnet; ComponentLink2Description: https://cdn.amphenol-icc.com/media/wysiwyg/files/drawing/67996.pdf?src-supplier=Avnet; ComponentLink3URL: https://cdn.amphenol-icc.com/media/wysiwyg/files/drawing/67996.pdf?src-supplier=Allied+Electronics; ComponentLink3Description: https://cdn.amphenol-icc.com/media/wysiwyg/files/drawing/67996.pdf?src-supplier=Allied+Electronics; ComponentLink4URL: https://cdn.amphenol-icc.com/media/wysiwyg/files/drawing/67996.pdf?src-supplier=Mouser; ComponentLink4Description: https://cdn.amphenol-icc.com/media/wysiwyg/files/drawing/67996.pdf?src-supplier=Mouser; ComponentLink5URL: https://cdn.amphenol-icc.com/media/wysiwyg/files/drawing/67996.pdf?src-supplier=Heilind+Electronics; ComponentLink5Description: https://cdn.amphenol-icc.com/media/wysiwyg/files/drawing/67996.pdf?src-supplier=Heilind+Electronics; Supplier Part Number 1: 28AH8858
JP2 = 68001-204HLF: Conn Unshrouded Header HDR 4 POS 2.54mm Solder ST Thru-Hole Bag; Manufacturer: Amphenol ICC / FCI; Supplier 1: Avnet; Manufacturer Part Number: 68001-204HLF; RoHS: No; Category: Headers and Wire Housings; Stock 1: 826; Pricing 1: 1=0.47800, 10=0.33500, 25=0.33100, 50=0.32700, 100=0.32400, 250=0.30200, 500=0.28000 (USD); Supplier Part Number 1: 52M9921
JP3 JP4 = 68000-103HLF: Conn Unshrouded Header HDR 3 POS 2.54mm Solder ST Top Entry Thru-Hole BergStik® Automotive Bulk; Manufacturer: Amphenol ICC / FCI; Supplier 1: Avnet; Manufacturer Part Number: 68000-103HLF; RoHS: No; Category: Headers and Wire Housings; Stock 1: 3919; Pricing 1: 4000=0.13392, 6000=0.12834, 10000=0.12276 (USD); ComponentLink1URL: https://datasheet.ciiva.com/46392/1914865-46392021.pdf?src-supplier=Element14; ComponentLink1Description: https://datasheet.ciiva.com/46392/1914865-46392021.pdf?src-supplier=Element14; Supplier Part Number 1: 68000-103HLF
L1 = L1210R2R2MDWIT: Inductor RF Chip Wirewound 2.2uH 20% 100KHz 1.13A 0.104Ohm DCR 1210 T/R; Manufacturer: KEMET; Core Material: Ferrite; Shielding: Unshielded; Self Resonant Frequency: 190MHz; DC Resistance (DCR): 80mR; Supplier 1: Newark; Manufacturer Part Number: L1210R2R2MDWIT; RoHS: Yes; Category: Fixed Inductors; Stock 1: 580; Pricing 1: 1=0.50000, 10=0.34400, 25=0.33400, 50=0.32300, 100=0.31300, 250=0.29400 (USD); Mount: Surface Mount; Case/Package: 1210; Case Code (Metric): 3225; Case Code (Imperial): 1210; Min Operating Temperature: -40°C; Max Operating Temperature: 105°C; Tolerance: 20%; Inductance: 2.2uH; Max DC Current: 2A; Package Quantity: 1000; Current Rating: 2A; Packaging: Tape and Reel; Inductance Tolerance: 20%; Resistor Type: Wirewound,Ceramic; Test Frequency: 100kHz; Termination: SMD/SMT; DC Current: 1.13A; Series: L-DWI; Length: 0.126inch; Width: 0.098inch; Height: 2.5mm; Height - Seated (Max): 0.106inch; Depth: 2.7mm; Radiation Hardening: No; REACH SVHC: No SVHC; Military Standard: Not; RoHS Compliant: Yes; ComponentLink1URL: https://datasheet.ciiva.com/4957/f3115-4957838.pdf?src-supplier=Mouser; ComponentLink1Description: https://datasheet.ciiva.com/4957/f3115-4957838.pdf?src-supplier=Mouser; ComponentLink2URL: https://datasheet.ciiva.com/6691/f3115-6691487.pdf?src-supplier=Digi-Key; ComponentLink2Description: https://datasheet.ciiva.com/6691/f3115-6691487.pdf?src-supplier=Digi-Key; ComponentLink3URL: https://datasheet.ciiva.com/8512/f3115-8512543.pdf?src-supplier=Avnet; ComponentLink3Description: https://datasheet.ciiva.com/8512/f3115-8512543.pdf?src-supplier=Avnet; ComponentLink4URL: https://datasheet.ciiva.com/17280/f3115-17280270.pdf?src-supplier=Avnet+Europe; ComponentLink4Description: https://datasheet.ciiva.com/17280/f3115-17280270.pdf?src-supplier=Avnet+Europe; ComponentLink5URL: https://datasheet.ciiva.com/22685/27262-22685038.pdf?src-supplier=Element14; ComponentLink5Description: https://datasheet.ciiva.com/22685/27262-22685038.pdf?src-supplier=Element14; Supplier Part Number 1: 24AJ1149
LINK1-LINK3 = QPC02SXGN-RC: 2 Position 2.54 mm Centerline Single Circuit Open Top Jumper; Manufacturer: Sullins; Number of Positions: 2; Pitch: 0.1inch; Supplier 1: Digi-Key; Manufacturer Part Number: QPC02SXGN-RC; RoHS: Yes; Category: Connectors; Stock 1: 1550673; Pricing 1: 1=0.10000, 10=0.05000, 25=0.04080, 50=0.03780, 100=0.03650, 250=0.03152, 500=0.03024, 1000=0.02646, 2500=0.02394 (USD); Case/Package: 100; Contact Plating: Gold; Package Quantity: 2000; Packaging: Bulk; Height: 0.235inch; Lead Free: Lead Free; ComponentLink1URL: https://datasheet.ciiva.com/767/284-sxgn-11510-767869.pdf?src-supplier=Digi-Key; ComponentLink1Description: https://datasheet.ciiva.com/767/284-sxgn-11510-767869.pdf?src-supplier=Digi-Key; Supplier Part Number 1: S9337-ND
MH1 = MH_7.4MMNC_3.2MMD: Mounting Hole 7.4mm Diameter (Non Copper), 3.2mm Drill NPTH
MH2-MH4 = MH_7.4MMC_3.2MMD: Mounting Hole 7.4mm Diameter, 3.2mm Drill
R1 R2 R19 R20 R25 = RC0805FR-07560RL: Chip resistance 560Ω ± 1.00% 0.125W ± 100ppm/℃ 0805; Manufacturer: Yageo; Tolerance: 1%; Temperature Coefficient: 100ppm/°C; Power Rating: 125mW; Voltage Rating: 150V; Supplier 1: RSComponents; Manufacturer Part Number: RC0805FR-07560RL; RoHS: Yes; Category: Chip SMD Resistors; Stock 1: 3800; Pricing 1: 5000=0.00300 (GBP); Case/Package: 0805; Case Code (Metric): 2012; Case Code (Imperial): 0805; Weight: 0.000194oz; Size Code: 0805; Min Operating Temperature: -55°C; Max Operating Temperature: 155°C; Resistance: 560R; Resistor Type: Thick Film; Packaging: Tape and Reel; Package Quantity: 1; Number of Terminations: 2; Termination: SMD/SMT; Max Power Dissipation: 125mW; Features: Moisture Resistant; Series: RC; Resistance Tolerance: 1%; Construction: Rectangular; Length: 2mm; Width: 0.049inch; Height: 0.024inch; Depth: 1.25mm; REACH SVHC: Unknown; Lead Free: Lead Free; RoHS Compliant: Yes; Military Standard: Not; Supplier Part Number 1: 1995727
R3 = RC0805FR-07100KL: Chip resistance 100000Ω ± 1.00% 0.125W ± 100ppm/℃ 0805; Manufacturer: Yageo; Tolerance: 1%; Resistance: 100kR; Temperature Coefficient: 100ppm/°C; Power Rating: 125mW; Voltage Rating (DC): 150V; Supplier 1: RSComponents; Manufacturer Part Number: RC0805FR-07100KL; RoHS: Yes; Category: Chip SMD Resistors; Stock 1: 23600; Pricing 1: 5000=0.00400, 25000=0.00400, 50000=0.00400, 100000=0.00300, 200000=0.00300 (GBP); Case/Package: 0805; Number of Pins: 2; Case Code (Metric): 2012; Case Code (Imperial): 0805; Size Code: 0805; Min Operating Temperature: -55°C; Max Operating Temperature: 155°C; Resistor Type: Thick Film; Packaging: Tape and Reel; Voltage Rating: 150V; Package Quantity: 1; Number of Terminations: 2; Termination: SMD/SMT; Max Power Dissipation: 125mW; Features: Moisture Resistant; Series: RC; Construction: Rectangular; Resistance Tolerance: 1%; Technology: THICK FILM; Length: 2mm; Width: 0.049inch; Height: 0.024inch; Depth: 1.25mm; Lead Pitch: 0.4mm; REACH SVHC: Unknown; Lead Free: Lead Free; RoHS Compliant: Yes; Military Standard: Not; ComponentLink1URL: https://datasheet.ciiva.com/11808/0900766b8106beab-11808858.pdf?src-supplier=RSComponents; ComponentLink1Description: https://datasheet.ciiva.com/11808/0900766b8106beab-11808858.pdf?src-supplier=RSComponents; ComponentLink2URL: https://datasheet.ciiva.com/7941/1686128-7941677.pdf?src-supplier=Element14; ComponentLink2Description: https://datasheet.ciiva.com/7941/1686128-7941677.pdf?src-supplier=Element14; ComponentLink3URL: https://datasheet.ciiva.com/7660/38627-7660796.pdf?src-supplier=Element14; ComponentLink3Description: https://datasheet.ciiva.com/7660/38627-7660796.pdf?src-supplier=Element14; ComponentLink4URL: https://datasheet.ciiva.com/22747/444164-22747534.pdf?src-supplier=Element14; ComponentLink4Description: https://datasheet.ciiva.com/22747/444164-22747534.pdf?src-supplier=Element14; ComponentLink5URL: https://datasheet.ciiva.com/2457/pyu-r-int-thick-7-2457018.pdf?src-supplier=Digi-Key; ComponentLink5Description: https://datasheet.ciiva.com/2457/pyu-r-int-thick-7-2457018.pdf?src-supplier=Digi-Key; ComponentLink6URL: https://datasheet.ciiva.com/2457/pyu-r-int-thick-7-2457019.pdf?src-supplier=Digi-Key; ComponentLink6Description: https://datasheet.ciiva.com/2457/pyu-r-int-thick-7-2457019.pdf?src-supplier=Digi-Key; ComponentLink7URL: https://datasheet.ciiva.com/2457/pyu-r-int-thick-7-2457017.pdf?src-supplier=Digi-Key; ComponentLink7Description: https://datasheet.ciiva.com/2457/pyu-r-int-thick-7-2457017.pdf?src-supplier=Digi-Key; ComponentLink8URL: https://datasheet.ciiva.com/12667/rc0805-12667001.pdf?src-supplier=Mouser; ComponentLink8Description: https://datasheet.ciiva.com/12667/rc0805-12667001.pdf?src-supplier=Mouser; ComponentLink9URL: https://datasheet.ciiva.com/7941/1697719-7941676.pdf?src-supplier=Element14; ComponentLink9Description: https://datasheet.ciiva.com/7941/1697719-7941676.pdf?src-supplier=Element14; ComponentLink10URL: https://datasheet.ciiva.com/7941/1697719-7941678.pdf?src-supplier=Element14; ComponentLink10Description: https://datasheet.ciiva.com/7941/1697719-7941678.pdf?src-supplier=Element14; ComponentLink11URL: https://datasheet.ciiva.com/16747/rc0805-16747226.pdf?src-supplier=Future+Electronics; ComponentLink11Description: https://datasheet.ciiva.com/16747/rc0805-16747226.pdf?src-supplier=Future+Electronics; Supplier Part Number 1: 1995648
R4 R9 R14 R15 = RC0805JR-070RL: Chip resistance 0Ω ±5% 1/8W 0805; Manufacturer: Yageo; Resistance: 0mR; Power Rating: 125mW; Voltage Rating: 150V; Temperature Coefficient: 200ppm/°C; Supplier 1: RSComponents; Manufacturer Part Number: RC0805JR-070RL; RoHS: Yes; Category: Chip SMD Resistors; Stock 1: 1700; Pricing 1: 100=0.00700, 1000=0.00700, 2500=0.00600, 5000=0.00600, 10000=0.00500 (GBP); Case/Package: 0805; Number of Pins: 2; Contact Plating: Tin,Matte; Case Code (Imperial): 0805; Case Code (Metric): 2012; Size Code: 0805; Min Operating Temperature: -55°C; Max Operating Temperature: 155°C; Resistor Type: Thick Film; Tolerance: 5%; Packaging: Tape and Reel; Voltage Rating (DC): 150V; Termination: SMD/SMT; Features: Moisture Resistant; Series: RC; Max Power Dissipation: 125mW; Number of Terminations: 2; Construction: Rectangular; Technology: THICK FILM; Resistance Tolerance: 5%; Length: 2mm; Width: 1.25mm; Height: 0.5mm; Depth: 1.25mm; Radiation Hardening: No; RoHS Compliant: Yes; REACH SVHC: Unknown; Military Standard: Not; Lead Free: Lead Free; ComponentLink1URL: https://datasheet.ciiva.com/11819/0900766b8106beab-11819430.pdf?src-supplier=RSComponents; ComponentLink1Description: https://datasheet.ciiva.com/11819/0900766b8106beab-11819430.pdf?src-supplier=RSComponents; ComponentLink2URL: https://datasheet.ciiva.com/7941/1738694-7941861.pdf?src-supplier=Element14; ComponentLink2Description: https://datasheet.ciiva.com/7941/1738694-7941861.pdf?src-supplier=Element14; ComponentLink3URL: https://datasheet.ciiva.com/7941/1738694-7941862.pdf?src-supplier=Element14; ComponentLink3Description: https://datasheet.ciiva.com/7941/1738694-7941862.pdf?src-supplier=Element14; ComponentLink4URL: https://datasheet.ciiva.com/7941/1738694-7941863.pdf?src-supplier=Element14; ComponentLink4Description: https://datasheet.ciiva.com/7941/1738694-7941863.pdf?src-supplier=Element14; ComponentLink5URL: https://datasheet.ciiva.com/15190/getdatasheetpartid-330685-15190028.pdf?src-supplier=Verical; ComponentLink5Description: https://datasheet.ciiva.com/15190/getdatasheetpartid-330685-15190028.pdf?src-supplier=Verical; Supplier Part Number 1: 1995753
R5 R17 R21-R24 = RC0805FR-0710KL: Chip resistance 10000Ω ± 1.00% 0.125W ± 100ppm/℃ 0805; Manufacturer: Yageo; Resistance: 10kR; Tolerance: 1%; Temperature Coefficient: 100ppm/°C; Power Rating: 125mW; Voltage Rating: 150V; Supplier 1: RSComponents; Manufacturer Part Number: RC0805FR-0710KL; RoHS: Yes; Category: Chip SMD Resistors; Stock 1: 435000; Pricing 1: 5000=0.00700 (USD); Case/Package: 0805; Case Code (Imperial): 0805; Case Code (Metric): 2012; Size Code: 0805; Min Operating Temperature: -55°C; Max Operating Temperature: 155°C; Resistor Type: Thick Film; Packaging: Tape and Reel; Package Quantity: 1; Termination: SMD/SMT; Number of Terminations: 2; Max Power Dissipation: 125mW; Features: Moisture Resistant; Series: RC; Construction: Rectangular; Resistance Tolerance: 1%; Technology: THICK FILM; Length: 2mm; Width: 0.049inch; Height: 0.024inch; Depth: 1.25mm; REACH SVHC: Unknown; Lead Free: Lead Free; Military Standard: Not; RoHS Compliant: Yes; Supplier Part Number 1: 6185163